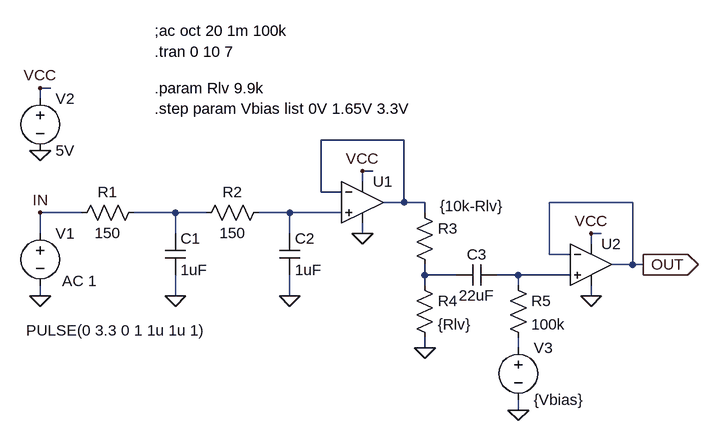
[diagram p0: schematic ArduinoLFO_Ouput_Board_Bias.asc]
ArduinoLFO_Ouput_Board_Bias.asc, the LTspice schematic file:
Version 4
SHEET 1 1508 680
WIRE 208 -96 192 -96
WIRE 192 -80 192 -96
WIRE 752 -16 624 -16
WIRE 704 32 688 32
WIRE 688 48 688 32
WIRE 624 64 624 -16
WIRE 656 64 624 64
WIRE 752 80 752 -16
WIRE 752 80 720 80
WIRE 784 80 752 80
WIRE 1104 80 976 80
WIRE 256 96 192 96
WIRE 400 96 336 96
WIRE 448 96 400 96
WIRE 576 96 528 96
WIRE 656 96 576 96
WIRE 784 96 784 80
WIRE 192 128 192 96
WIRE 400 128 400 96
WIRE 576 128 576 96
WIRE 688 128 688 112
WIRE 1056 128 1040 128
WIRE 1040 144 1040 128
WIRE 976 160 976 80
WIRE 1008 160 976 160
WIRE 1104 176 1104 80
WIRE 1104 176 1072 176
WIRE 1120 176 1104 176
WIRE 784 192 784 176
WIRE 832 192 784 192
WIRE 928 192 896 192
WIRE 1008 192 928 192
WIRE 784 208 784 192
WIRE 928 208 928 192
WIRE 192 224 192 208
WIRE 400 224 400 192
WIRE 576 224 576 192
WIRE 1040 224 1040 208
WIRE 784 304 784 288
WIRE 928 304 928 288
WIRE 928 400 928 384
FLAG 192 224 0
FLAG 192 96 IN
FLAG 400 224 0
FLAG 1120 176 OUT
IOPIN 1120 176 Out
FLAG 576 224 0
FLAG 688 32 VCC
FLAG 688 128 0
FLAG 192 0 0
FLAG 192 -96 VCC
FLAG 784 304 0
FLAG 928 400 0
FLAG 1040 128 VCC
FLAG 1040 224 0
SYMBOL voltage 192 112 R0
WINDOW 3 -22 165 Left 2
WINDOW 123 34 89 Left 2
WINDOW 39 0 0 Left 2
SYMATTR Value PULSE(0 3.3 0 1 1u 1u 1)
SYMATTR Value2 AC 1
SYMATTR InstName V1
SYMBOL cap 384 128 R0
SYMATTR InstName C1
SYMATTR Value 1uF
SYMBOL res 352 80 R90
WINDOW 0 0 56 VBottom 2
WINDOW 3 32 56 VTop 2
SYMATTR InstName R1
SYMATTR Value 150
SYMBOL cap 560 128 R0
SYMATTR InstName C2
SYMATTR Value 1uF
SYMBOL res 544 80 R90
WINDOW 0 0 56 VBottom 2
WINDOW 3 32 56 VTop 2
SYMATTR InstName R2
SYMATTR Value 150
SYMBOL Opamps\\UniversalOpamp2 688 80 R0
SYMATTR InstName U1
SYMBOL voltage 192 -96 R0
SYMATTR InstName V2
SYMATTR Value 5V
SYMBOL res 768 80 R0
WINDOW 3 39 6 Left 2
SYMATTR Value {10k-Rlv}
SYMATTR InstName R3
SYMBOL res 768 192 R0
SYMATTR InstName R4
SYMATTR Value {Rlv}
SYMBOL res 912 192 R0
SYMATTR InstName R5
SYMATTR Value 100k
SYMBOL cap 896 176 R90
WINDOW 0 0 32 VBottom 2
WINDOW 3 32 32 VTop 2
SYMATTR InstName C3
SYMATTR Value 22uF
SYMBOL voltage 928 288 R0
SYMATTR InstName V3
SYMATTR Value {Vbias}
SYMBOL Opamps\\UniversalOpamp2 1040 176 R0
SYMATTR InstName U2
TEXT 368 -152 Left 2 !.tran 0 10 7
TEXT 368 -184 Left 2 !;ac oct 20 1m 100k
TEXT 368 -96 Left 2 !.param Rlv 9.9k
TEXT 368 -64 Left 2 !.step param Vbias list 0V 1.65V 3.3V

The netlist it stands for:
* ArduinoLFO_Ouput_Board_Bias.asc
V1 IN 0 PULSE(0 3.3 0 1 1u 1u 1) AC 1
C1 N002 0 1uF
R1 N002 IN 150
C2 N003 0 1uF
R2 N003 N002 150
XU1 N003 N001 VCC 0 N001 level.2 Avol=1Meg GBW=10Meg Slew=10Meg ilimit=25m rail=0 Vos=0 phimargin=45 en=0 enk=0 in=0 ink=0 Rin=500Meg  ; pins IN+ IN- V+ V- OUT
V2 VCC 0 5V
R3 N001 N004 {10k-Rlv}
R4 N004 0 {Rlv}
R5 N005 N006 100k
C3 N005 N004 22uF
V3 N006 0 {Vbias}
XU2 N005 OUT VCC 0 OUT level.2 Avol=1Meg GBW=10Meg Slew=10Meg ilimit=25m rail=0 Vos=0 phimargin=45 en=0 enk=0 in=0 ink=0 Rin=500Meg  ; pins IN+ IN- V+ V- OUT
.tran 0 10 7
;ac oct 20 1m 100k
.param Rlv 9.9k
.step param Vbias list 0V 1.65V 3.3V
.lib UniversalOpamps2.sub
.backanno
.end